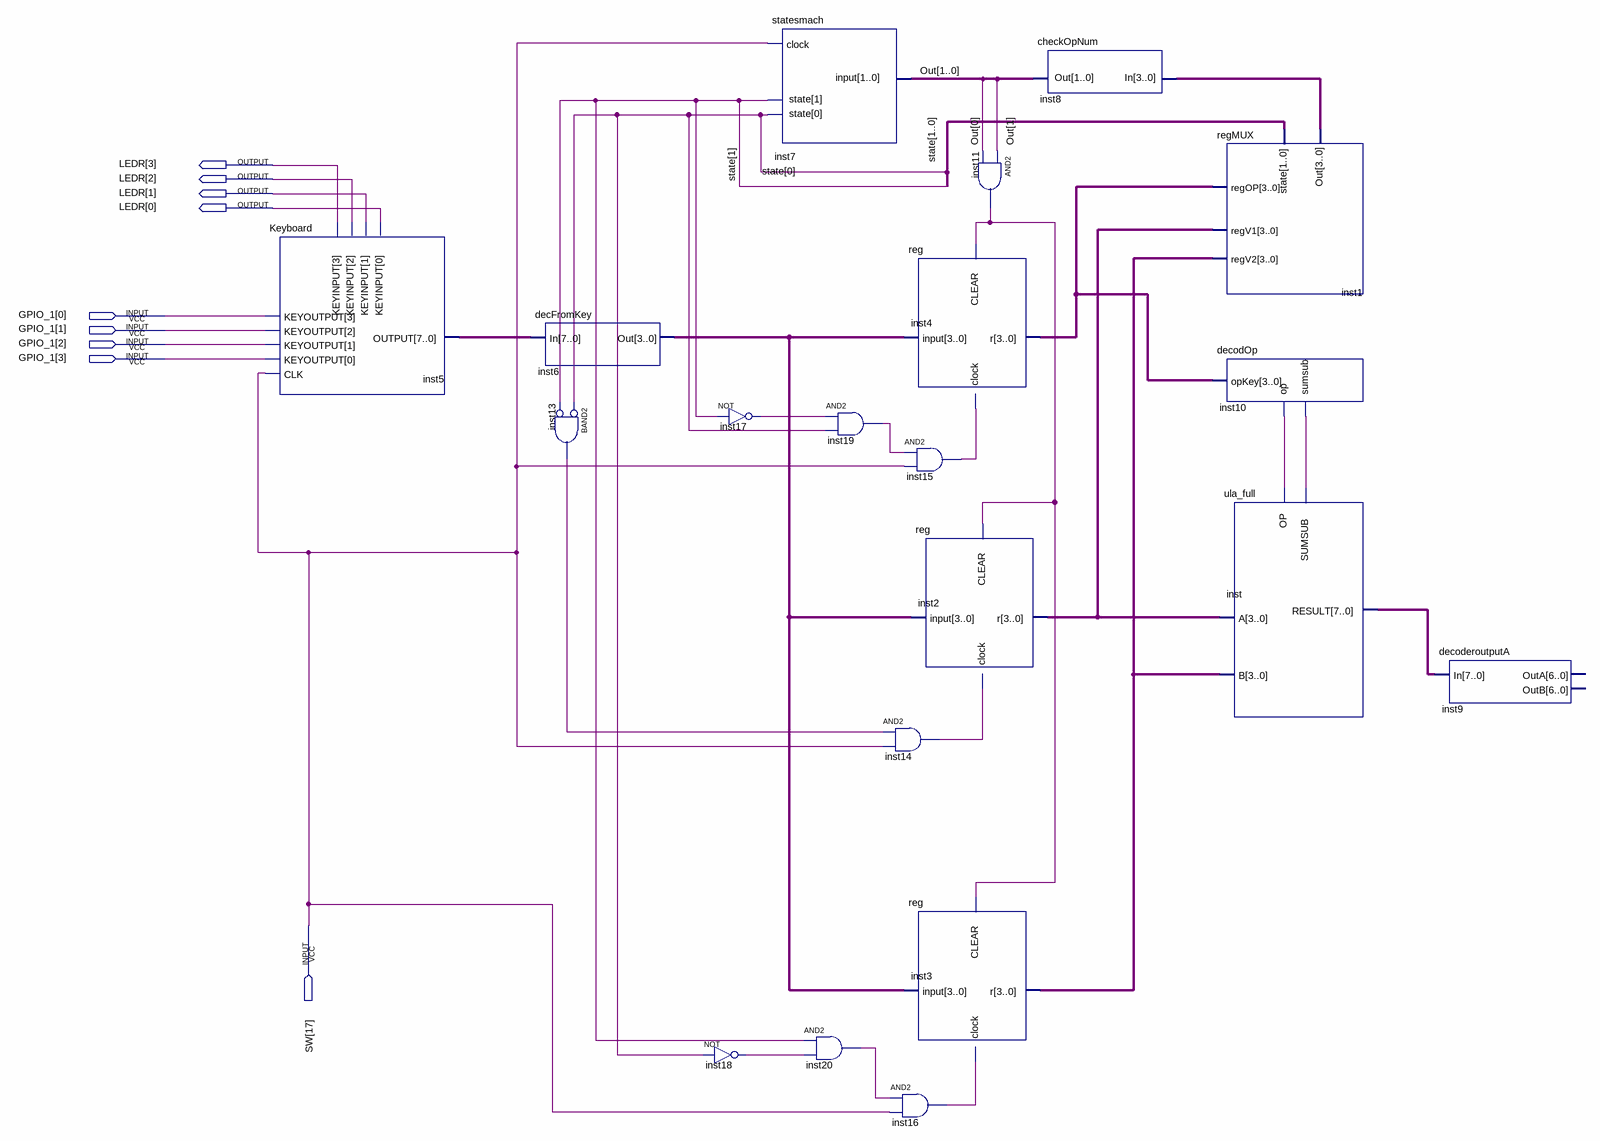
[diagram p0: schematic sheet]
// Quartus schematic calc.bdf as structural Verilog: 20 symbols, 9 pins
module calc (
  input  [3:0] GPIO_1,
  input  [17:17] SW,
  output [3:0] LEDR
);

  wire inst10_op, inst10_sumsub, inst11_out, inst13_out, inst14_out, inst15_out, inst16_out, inst17_out,
       inst18_out, inst19_out, inst20_out;
  wire [1:0] Out, state;
  wire [3:0] inst1_out, inst2_r, inst3_r, inst4_r, inst6_out;
  wire [7:0] inst5_output, inst_result;

  Keyboard inst5 (
    .CLK(SW[17]), .KEYOUTPUT({GPIO_1[0], GPIO_1[1], GPIO_1[2], GPIO_1[3]}), .KEYINPUT(LEDR),
    .OUTPUT(inst5_output));
  decFromKey inst6 (.In(inst5_output), .Out(inst6_out));
  and inst13 (inst13_out, ~state[0], ~state[1]);  // BAND2
  not inst17 (inst17_out, state[1]);
  not inst18 (inst18_out, state[0]);
  statesmach inst7 (.\input (Out), .clock(SW[17]), .state(state));
  and inst19 (inst19_out, inst17_out, state[0]);
  and inst20 (inst20_out, state[1], inst18_out);
  and inst14 (inst14_out, inst13_out, SW[17]);
  and inst16 (inst16_out, inst20_out, SW[17]);
  \reg  inst4 (.CLEAR(inst11_out), .\input (inst6_out), .clock(inst15_out), .r(inst4_r));
  and inst15 (inst15_out, inst19_out, SW[17]);
  \reg  inst2 (.CLEAR(inst11_out), .\input (inst6_out), .clock(inst14_out), .r(inst2_r));
  \reg  inst3 (.CLEAR(inst11_out), .\input (inst6_out), .clock(inst16_out), .r(inst3_r));
  and inst11 (inst11_out, Out[1], Out[0]);
  checkOpNum inst8 (.In(inst1_out), .Out(Out));
  regMUX inst1 (.state(state), .regV1(inst2_r), .regV2(inst3_r), .regOP(inst4_r), .Out(inst1_out));
  decodOp inst10 (.opKey(inst4_r), .sumsub(inst10_sumsub), .op(inst10_op));
  ula_full inst (.OP(inst10_op), .A(inst2_r), .B(inst3_r), .SUMSUB(inst10_sumsub), .RESULT(inst_result));
  decoderoutputA inst9 (.In(inst_result));  // open: OutA, OutB
endmodule
